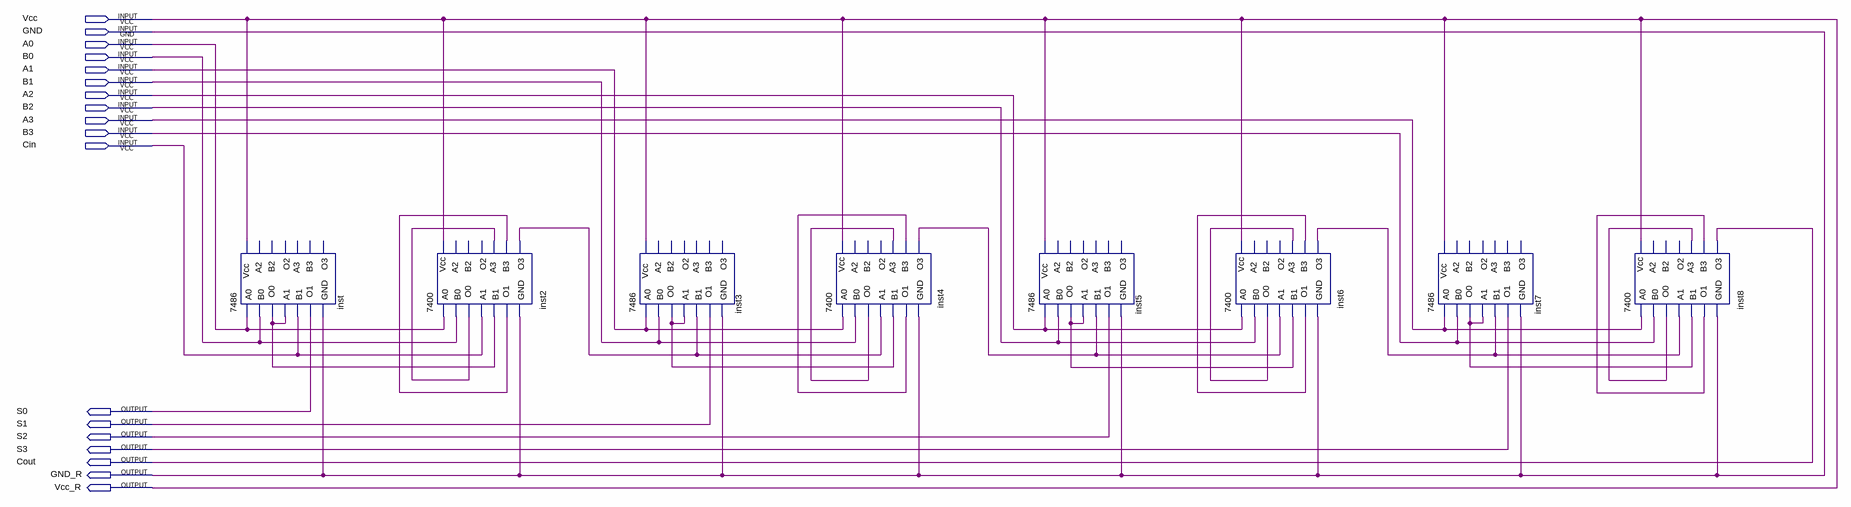
[diagram p0: schematic sheet]
// Quartus schematic Circuit_3.bdf as structural Verilog: 8 symbols, 18 pins
module Circuit_3 (
  input  Vcc,
  input  GND,
  input  A0,
  input  B0,
  input  A1,
  input  B1,
  input  A2,
  input  B2,
  input  A3,
  input  B3,
  input  Cin,
  output S0,
  output S1,
  output S2,
  output S3,
  output Cout,
  output GND_R,
  output Vcc_R
);

  wire inst2_o0, inst2_o1, inst2_o3, inst3_o0, inst4_o0, inst4_o1, inst4_o3, inst5_o0, inst6_o0, inst6_o1,
       inst6_o3, inst7_o0, inst8_o0, inst8_o1, inst_o0;

  \7486  inst (
    .Vcc(Vcc), .A0(A0), .B0(B0), .A1(inst_o0), .B1(Cin), .GND(GND), .O0(inst_o0), .O1(S0));  // open: A2, B2, A3, B3, O2, O3
  \7400  inst2 (
    .Vcc(Vcc), .A0(A0), .B0(B0), .A1(Cin), .B1(inst_o0), .A3(inst2_o0), .B3(inst2_o1), .GND(GND),
    .O0(inst2_o0), .O1(inst2_o1), .O3(inst2_o3));  // open: A2, B2, O2
  \7486  inst3 (
    .Vcc(Vcc), .A0(A1), .B0(B1), .A1(inst3_o0), .B1(inst2_o3), .GND(GND), .O0(inst3_o0), .O1(S1));  // open: A2, B2, A3, B3, O2, O3
  \7400  inst4 (
    .Vcc(Vcc), .A0(A1), .B0(B1), .A1(inst2_o3), .B1(inst3_o0), .A3(inst4_o0), .B3(inst4_o1), .GND(GND),
    .O0(inst4_o0), .O1(inst4_o1), .O3(inst4_o3));  // open: A2, B2, O2
  \7486  inst5 (
    .Vcc(Vcc), .A0(A2), .B0(B2), .A1(inst5_o0), .B1(inst4_o3), .GND(GND), .O0(inst5_o0), .O1(S2));  // open: A2, B2, A3, B3, O2, O3
  \7400  inst6 (
    .Vcc(Vcc), .A0(A2), .B0(B2), .A1(inst4_o3), .B1(inst5_o0), .A3(inst6_o0), .B3(inst6_o1), .GND(GND),
    .O0(inst6_o0), .O1(inst6_o1), .O3(inst6_o3));  // open: A2, B2, O2
  \7486  inst7 (
    .Vcc(Vcc), .A0(A3), .B0(B3), .A1(inst7_o0), .B1(inst6_o3), .GND(GND), .O0(inst7_o0), .O1(S3));  // open: A2, B2, A3, B3, O2, O3
  \7400  inst8 (
    .Vcc(Vcc), .A0(A3), .B0(B3), .A1(inst6_o3), .B1(inst7_o0), .A3(inst8_o0), .B3(inst8_o1), .GND(GND),
    .O0(inst8_o0), .O1(inst8_o1), .O3(Cout));  // open: A2, B2, O2

  assign GND_R = GND;
  assign Vcc_R = Vcc;
endmodule
